# Altium project BoardControl.PrjPcb
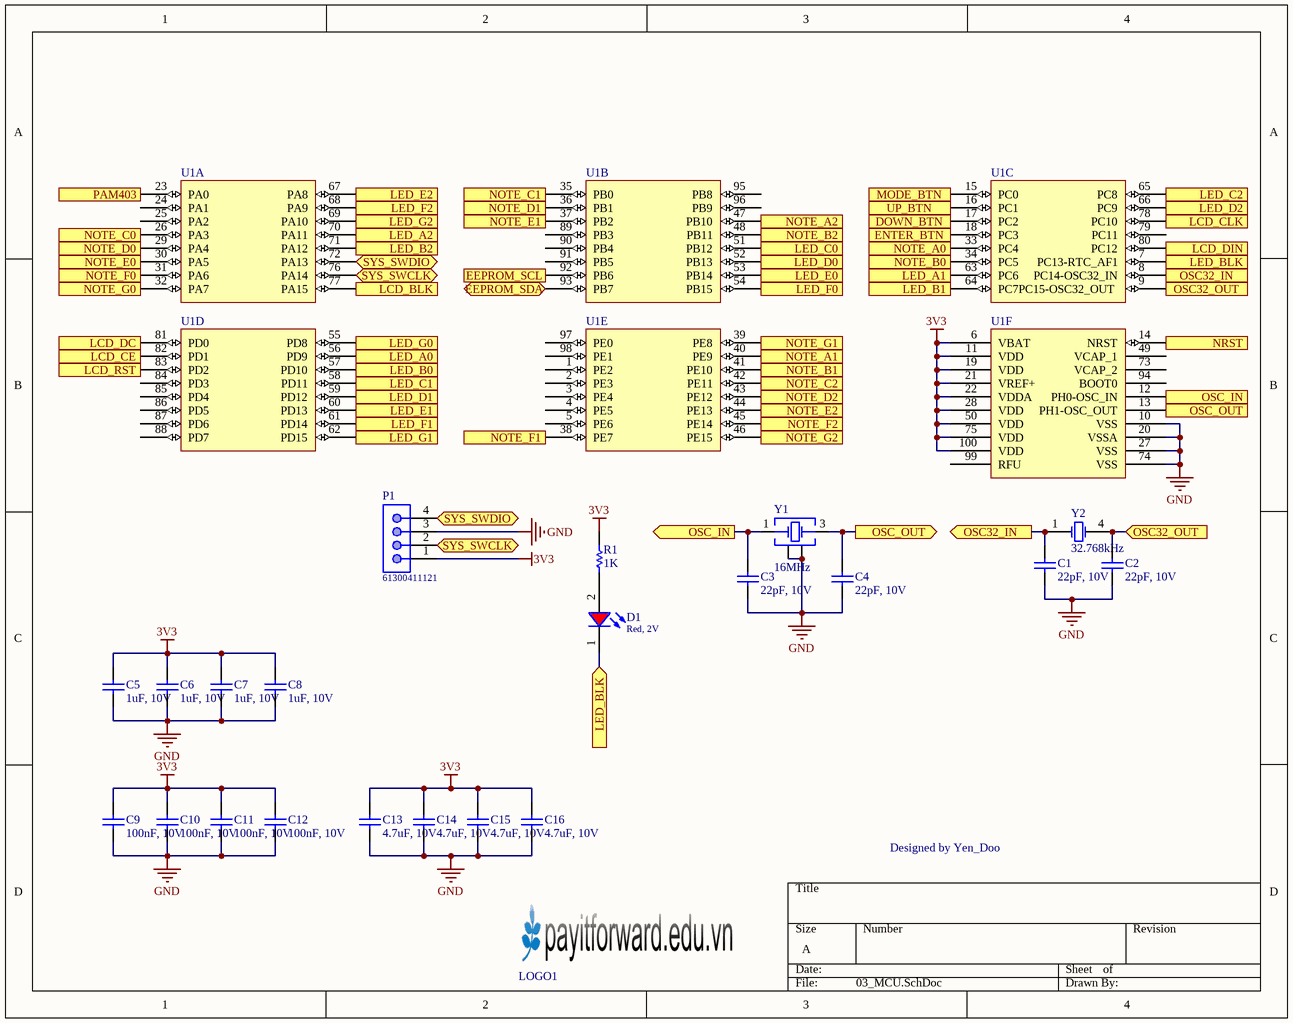
[diagram p0: 03_MCU.SchDoc]
3 sheets, 51 parts. Net scope: flat (ports and power ports of the same name join across sheets).
Board file: PCB3.PcbDoc
Sheets:
  03_MCU.SchDoc
  04_Input_Output.SchDoc
  05_Supply_Power.SchDoc

## Sheet 03_MCU.SchDoc
size A; SheetNumber: 1; SheetTotal: 3

### Parts
*  LOGO_DOO  [Logo_Top_Overlay]  (value not drawn)
C1  22pF, 10V  [WCAP-CSGP_0603_H=0.8mm_Reflow]
C2  22pF, 10V  [WCAP-CSGP_0603_H=0.8mm_Reflow]
C3  22pF, 10V  [WCAP-CSGP_0603_H=0.8mm_Reflow]
C4  22pF, 10V  [WCAP-CSGP_0603_H=0.8mm_Reflow]
C5  1uF, 10V  [WCAP-CSGP_0603_H=0.8mm_Reflow]
C6  1uF, 10V  [WCAP-CSGP_0603_H=0.8mm_Reflow]
C7  1uF, 10V  [WCAP-CSGP_0603_H=0.8mm_Reflow]
C8  1uF, 10V  [WCAP-CSGP_0603_H=0.8mm_Reflow]
C9  100nF, 10V  [WCAP-CSGP_0603_H=0.8mm_Reflow]
C10  100nF, 10V  [WCAP-CSGP_0603_H=0.8mm_Reflow]
C11  100nF, 10V  [WCAP-CSGP_0603_H=0.8mm_Reflow]
C12  100nF, 10V  [WCAP-CSGP_0603_H=0.8mm_Reflow]
C13  4.7uF, 10V  [WCAP-CSGP_0603_H=0.8mm_Reflow]
C14  4.7uF, 10V  [WCAP-CSGP_0603_H=0.8mm_Reflow]
C15  4.7uF, 10V  [WCAP-CSGP_0603_H=0.8mm_Reflow]
C16  4.7uF, 10V  [WCAP-CSGP_0603_H=0.8mm_Reflow]
D1  Red, 2V  [WL-SMCW_0603_H=0.7mm]
LOGO1  LOGO PIF  [PIF LOGO BIG SSTOP]  (value not drawn)
P1  61300411121  [61300411121]
R1  value 1K  [RES-SM-0603]  (hidden comment: RESISTOR SMD)
U1  STM32F205VCT6  [STM32F205VCT6]  (value not drawn)  (parts A,B,C,D,E,F of 6)
Y1  16MHz  [WE-XTAL_12SMX]
Y2  32.768kHz  [WE-XTAL_85SMX]

### Ports
DOWN_BTN (in), EEPROM_SCL (out), EEPROM_SDA (bidir), ENTER_BTN (in), LCD_BLK (out), LCD_CE (out), LCD_CLK (out), LCD_DC (out), LCD_DIN (in), LCD_RST (out), LED_A0 (out), LED_A1 (out), LED_A2 (out), LED_B0 (out), LED_B1 (out), LED_B2 (out), LED_BLK (in), LED_BLK (out), LED_C0 (out), LED_C1 (out), LED_C2 (out), LED_D0 (out), LED_D1 (out), LED_D2 (out), LED_E0 (out), LED_E1 (out), LED_E2 (out), LED_F0 (out), LED_F1 (out), LED_F2 (out), LED_G0 (out), LED_G1 (out), LED_G2 (out), MODE_BTN (in), NOTE_A0 (in), NOTE_A1 (in), NOTE_A2 (in), NOTE_B0 (in), NOTE_B1 (in), NOTE_B2 (in), NOTE_C0 (in), NOTE_C1 (in), NOTE_C2 (in), NOTE_D0 (in), NOTE_D1 (in), NOTE_D2 (in), NOTE_E0 (in), NOTE_E1 (in), NOTE_E2 (in), NOTE_F0 (in), NOTE_F1 (in), NOTE_F2 (in), NOTE_G0 (in), NOTE_G1 (in), NOTE_G2 (in), NRST (in), OSC32_IN (in), OSC32_IN (out), OSC32_OUT (in), OSC32_OUT (out), OSC_IN (in), OSC_IN (out), OSC_OUT (out), PAM403 (out), SYS_SWCLK (bidir), SYS_SWDIO (bidir), UP_BTN (in)

### Nets
3V3: C5.2 C6.2 C7.2 C8.2 C9.2 C10.2 C11.2 C12.2 C13.1 C14.1 C15.1 C16.1 P1.1 R1.2 U1.6(VBAT) U1.11(VDD) U1.19(VDD) U1.21(VREF+) U1.22(VDDA) U1.28(VDD) U1.50(VDD) U1.75(VDD) U1.100(VDD)
GND: C1.1 C2.1 C3.1 C4.1 C5.1 C6.1 C7.1 C8.1 C9.1 C10.1 C11.1 C12.1 C13.2 C14.2 C15.2 C16.2 P1.3 U1.10(VSS) U1.20(VSSA) U1.27(VSS) U1.74(VSS) Y1.2(GND_&_Lid) Y1.4(GND_&_Lid)
NetC1_2: C1.2 U1.8(PC14-OSC32_IN) Y2.1(Crystal) ; port OSC32_IN
NetC2_2: C2.2 U1.9(PC15-OSC32_OUT) Y2.4(Crystal) ; port OSC32_OUT
NetC3_2: C3.2 U1.12(PH0-OSC_IN) Y1.1(Crystal) ; port OSC_IN
NetC4_2: C4.2 U1.13(PH1-OSC_OUT) Y1.3(Crystal) ; port OSC_OUT
NetD1_1: D1.1(K) U1.7(PC13-RTC_AF1) ; port LED_BLK
NetD1_2: D1.2(A) R1.1
NetP1_2: P1.2 U1.76(PA14) ; port SYS_SWCLK
NetP1_4: P1.4 U1.72(PA13) ; port SYS_SWDIO
NetP2_1: U1.18(PC3) ; port ENTER_BTN
NetP2_2: U1.17(PC2) ; port DOWN_BTN
NetP2_3: U1.16(PC1) ; port UP_BTN
NetP2_4: U1.15(PC0) ; port MODE_BTN
NetP2_5: U1.14(NRST) ; port NRST
NetP3_1: U1.71(PA12) ; port LED_B2
NetP3_2: U1.70(PA11) ; port LED_A2
NetP3_3: U1.69(PA10) ; port LED_G2
NetP3_4: U1.68(PA9) ; port LED_F2
NetP3_5: U1.67(PA8) ; port LED_E2
NetP3_6: U1.66(PC9) ; port LED_D2
NetP3_7: U1.65(PC8) ; port LED_C2
NetP3_8: U1.64(PC7) ; port LED_B1
NetP3_9: U1.63(PC6) ; port LED_A1
NetP3_10: U1.62(PD15) ; port LED_G1
NetP3_11: U1.61(PD14) ; port LED_F1
NetP3_12: U1.60(PD13) ; port LED_E1
NetP3_13: U1.59(PD12) ; port LED_D1
NetP3_14: U1.58(PD11) ; port LED_C1
NetP3_15: U1.57(PD10) ; port LED_B0
NetP3_16: U1.56(PD9) ; port LED_A0
NetP3_17: U1.55(PD8) ; port LED_G0
NetP3_18: U1.54(PB15) ; port LED_F0
NetP3_19: U1.53(PB14) ; port LED_E0
NetP3_20: U1.52(PB13) ; port LED_D0
NetP3_21: U1.51(PB12) ; port LED_C0
NetP4_2: U1.48(PB11) ; port NOTE_B2
NetP4_3: U1.47(PB10) ; port NOTE_A2
NetP4_4: U1.46(PE15) ; port NOTE_G2
NetP4_5: U1.45(PE14) ; port NOTE_F2
NetP4_6: U1.44(PE13) ; port NOTE_E2
NetP4_7: U1.43(PE12) ; port NOTE_D2
NetP4_8: U1.42(PE11) ; port NOTE_C2
NetP4_9: U1.41(PE10) ; port NOTE_B1
NetP4_10: U1.40(PE9) ; port NOTE_A1
NetP4_11: U1.39(PE8) ; port NOTE_G1
NetP4_12: U1.38(PE7) ; port NOTE_F1
NetP4_13: U1.37(PB2) ; port NOTE_E1
NetP4_14: U1.36(PB1) ; port NOTE_D1
NetP4_15: U1.35(PB0) ; port NOTE_C1
NetP4_16: U1.34(PC5) ; port NOTE_B0
NetP4_17: U1.33(PC4) ; port NOTE_A0
NetP4_18: U1.32(PA7) ; port NOTE_G0
NetP4_19: U1.31(PA6) ; port NOTE_F0
NetP4_20: U1.30(PA5) ; port NOTE_E0
NetP4_21: U1.29(PA4) ; port NOTE_D0
NetP4_22: U1.26(PA3) ; port NOTE_C0
NetP5_2: U1.77(PA15) ; port LCD_BLK
NetP5_4: U1.78(PC10) ; port LCD_CLK
NetP5_5: U1.80(PC12) ; port LCD_DIN
NetP5_6: U1.81(PD0) ; port LCD_DC
NetP5_7: U1.82(PD1) ; port LCD_CE
NetP5_8: U1.83(PD2) ; port LCD_RST
NetR3_1: U1.92(PB6) ; port EEPROM_SCL
NetR4_1: U1.93(PB7) ; port EEPROM_SDA
NetU1_23: U1.23(PA0) ; port PAM403

Not connected (* = marked no-connect by the designer): U1 1(PE2) 2(PE3) 3(PE4) 4(PE5) 5(PE6) 24(PA1) 25(PA2) 49(VCAP_1) 73(VCAP_2) 79(PC11) 84(PD3) 85(PD4) 86(PD5) 87(PD6) 88(PD7) 89(PB3) 90(PB4) 91(PB5) 94(BOOT0) 95(PB8) 96(PB9) 97(PE0) 98(PE1) 99(RFU)

### Notes on the sheet
- (in symbol LOGO_DOO) Designed by Yen_Doo

### Library data of the parts
C1-C4 = 885012006004: WCAP-CSGP Multilayer Ceramic Chip Capacitor, General Purpose, size 0603, NP0, 22pF, 10V; Manufacturer: Wurth Elektronik; Rated Voltage: 10VDC; Isolation Resistance: >=10GOhm; Capacitance Tolerance: +/-5%; Dissipation Factor: Q>=400+20C; Technical Reference: NP00603220J010DFCT10000; ComponentLink1Description: Manufacturer; ComponentLink1URL: http://www.we-online.de; ComponentLink2Description: Datasheet; ComponentLink2URL: https://www.we-online.com/catalog/datasheet/885012006004.pdf; Operating Temperature: -55 to +125degC; Packaging: Tape and Reel; Manufacturer Part Number: 885012006004; Published Date: May 2020; Ceramic Type: NP0; Height: 0.8mm; Mounting Technology: SMT; Size: 0603; Capacitance: 22pF
C5-C8 = 885012106010: WCAP-CSGP Multilayer Ceramic Chip Capacitor, General Purpose, size 0603, X5R, 1uF, 10V; Manufacturer: Wurth Elektronik; Rated Voltage: 10VDC; Isolation Resistance: >=0.1GOhm; Capacitance Tolerance: +/-20%; Technical Reference: X5R0603105M010DFCT10000; ComponentLink1Description: Manufacturer; ComponentLink1URL: http://www.we-online.de; ComponentLink2Description: Datasheet; ComponentLink2URL: https://www.we-online.com/catalog/datasheet/885012106010.pdf; Operating Temperature: -55 to +85degC; Packaging: Tape and Reel; Manufacturer Part Number: 885012106010; Published Date: May 2020; Ceramic Type: X5R; Dissipation Factor: =<10%; Height: 0.8mm; Mounting Technology: SMT; Size: 0603; Capacitance: 1uF
C9-C12 = 885012206020: WCAP-CSGP Multilayer Ceramic Chip Capacitor, General Purpose, size 0603, X7R, 100nF, 10V; Manufacturer: Wurth Elektronik; Rated Voltage: 10VDC; Isolation Resistance: >=5GOhm; Capacitance Tolerance: +/-10%; Technical Reference: X7R0603104K010DFCT10000; ComponentLink1Description: Manufacturer; ComponentLink1URL: http://www.we-online.de; ComponentLink2Description: Datasheet; ComponentLink2URL: https://www.we-online.com/catalog/datasheet/885012206020.pdf; Operating Temperature: -55 to +125degC; Packaging: Tape and Reel; Manufacturer Part Number: 885012206020; Published Date: May 2020; Ceramic Type: X7R; Dissipation Factor: =<5%; Height: 0.8mm; Mounting Technology: SMT; Size: 0603; Capacitance: 100nF
C13-C16 = 885012106012: WCAP-CSGP Multilayer Ceramic Chip Capacitor, General Purpose, size 0603, X5R, 4.7uF, 10V; Manufacturer: Wurth Elektronik; Rated Voltage: 10VDC; Isolation Resistance: >=0.02GOhm; Capacitance Tolerance: +/-20%; Technical Reference: X5R0603475M010DFCT10000; ComponentLink1Description: Manufacturer; ComponentLink1URL: http://www.we-online.de; ComponentLink2Description: Datasheet; ComponentLink2URL: https://www.we-online.com/catalog/datasheet/885012106012.pdf; Operating Temperature: -55 to +85degC; Packaging: Tape and Reel; Manufacturer Part Number: 885012106012; Published Date: May 2020; Ceramic Type: X5R; Dissipation Factor: =<10%; Height: 0.8mm; Mounting Technology: SMT; Size: 0603; Capacitance: 4.7uF
D1 = 150060RS75000: WL-SMCW SMT Mono-color Chip LED Waterclear, size 0603, Red, 2V, 140deg; Chip Technology: AlInGaP; Dominant Wavelength typ.: 625nm; Luminous Intensity typ.: 250mcd; Peak Wavelength typ.: 630nm; Viewing Angle: 140deg; ComponentLink1Description: Manufacturer; ComponentLink1URL: http://www.we-online.de; ComponentLink2URL: https://www.we-online.com/catalog/datasheet/150060RS75000.pdf; ComponentLink2Description: Datasheet; Forward Voltage typ.: 2V; Emitting Color: Red; Mounting Technology: SMT; Operating Temperature: -40 to +85degC; Published Date: December 2019; Part Number: 150060RS75000; Packaging: Tape and Reel; Size: 0603; Publisher: Wurth Elektronik
P1 = 61300411121: WR-PHD Pin Header, THT, pitch 2.54mm, Single Row, Vertical, 4p; Manufacturer: Wurth Elektronik; Pin Number: 4; Rated Current: 3A; Working Voltage: 250VAC; Withstanding Voltage: 500VAC; Contact Resistance: 20mOhm; ComponentLink1Description: Manufacturer; ComponentLink1URL: http://www.we-online.de; ComponentLink2Description: Datasheet; ComponentLink2URL: https://www.we-online.com/catalog/datasheet/61300411121.pdf; Manufacturer Part Number: 61300411121; Published Date: May 2020; Pitch: 2.54mm; Operating Temperature: -40 to +105degC; Mounting Technology: THT; Packaging: Bag; Gender: Pin Header; Row Number: Single; Orientation: Vertical
R1 = RESISTOR SMD: Resistor
U1 = STM32F205VCT6: ARM® Cortex®-M3 STM32F2 Microcontroller IC 32-Bit Single-Core 120MHz 256KB (256K x 8) FLASH 100-LQFP (14x14); Mfr: STMicroelectronics; Connectivity: CANbus, I²C, IrDA, LINbus, MMC, SPI, UART/USART, USB OTG; Peripherals: Brown-out Detect/Reset, DMA, I²S, LCD, POR, PWM, WDT; Number of I/O: 82; RAM Size: 100K x 8; Voltage - Supply (Vcc/Vdd): 1.8V ~ 3.6V; Data Converters: /D 16x12b; D/A 2x12b; Oscillator Type: Internal; Series: STM32F2; Core Processor: ARM® Cortex®-M3; Core Size: 32-Bit Single-Core; Speed: 120MHz; Program Memory Size: 256KB (256K x 8); Program Memory Type: FLASH; Operating Temperature: -40°C ~ 85°C (TA); Mounting Type: Surface Mount; Package / Case: 100-LQFP; Supplier Device Package: 100-LQFP (14x14); Base Product Number: STM32F205; ComponentLink1Description: Digikey; ComponentLink1URL: https://www.digikey.com/en/products/detail/stmicroelectronics/STM32F205VCT6/2640805
Y1 = 830026392: WE-XTAL Quartz Crystal, SMT, 12SMX, 16MHz, +/-30ppm; Manufacturer: Wurth Elektronik; Frequency Stability: +/-50ppm; Load Capacitance: 16pF; ComponentLink1Description: Manufacturer; ComponentLink1URL: http://www.we-online.de; ComponentLink2Description: Datasheet; ComponentLink2URL: https://katalog.we-online.com/pbs/datasheet/830026392.pdf; Operating Temperature: -20 to +70degC; Packaging: Tape and Reel; Manufacturer Part Number: 830026392; Published Date: July 2020; Size: 12SMX; Frequency: 16MHz; Frequency Tolerance: +/-30ppm; Mounting Technology: SMT
Y2 = 830016178: WE-XTAL Watch Crystal, SMT, 85SMX, 32.768kHz, +/-20ppm; Manufacturer: Wurth Elektronik; Load Capacitance: 6pF; ComponentLink1Description: Manufacturer; ComponentLink1URL: http://www.we-online.de; ComponentLink2Description: Datasheet; ComponentLink2URL: https://katalog.we-online.com/pbs/datasheet/830016178.pdf; Operating Temperature: -40 to +85degC; Packaging: Tape and Reel; Manufacturer Part Number: 830016178; Published Date: July 2020; Size: 85SMX; Frequency Stability: -; Frequency: 32.768kHz; Frequency Tolerance: +/-20ppm; Mounting Technology: SMT

## Sheet 04_Input_Output.SchDoc
size A; SheetNumber: 2; SheetTotal: 3
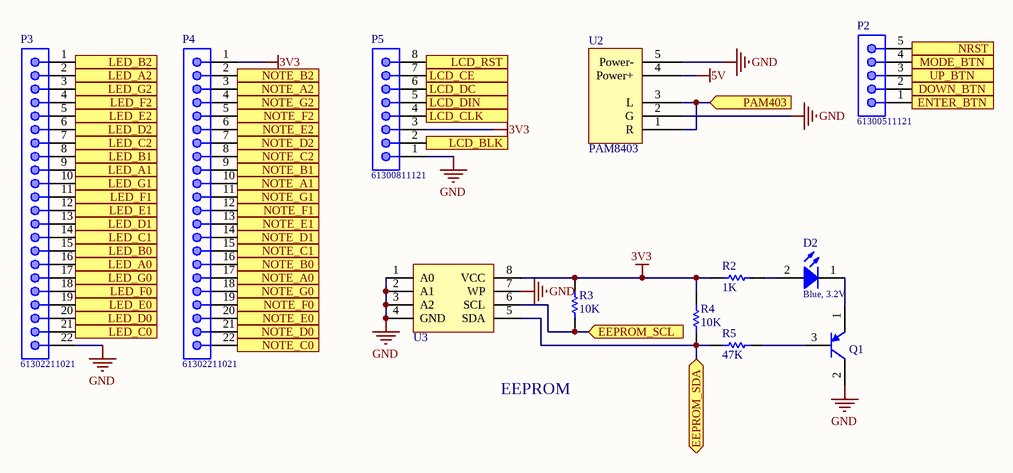
[diagram p1: 04_Input_Output.SchDoc]

### Parts
D2  Blue, 3.2V  [WL-SMCW_0603 dome]
P2  61300511121  [61300511121]
P3  61302211021  [61302211021]
P4  61302211021  [61302211021]
P5  61300811121  [61300811121]
Q1  A1015  [SOT23B]  (value not drawn)
R2  value 1K  [RES-SM-0603]  (hidden comment: RESISTOR SMD)
R3  value 10K  [RES-SM-0603]  (hidden comment: RESISTOR SMD)
R4  value 10K  [RES-SM-0603]  (hidden comment: RESISTOR SMD)
R5  value 47K  [RES-SM-0603]  (hidden comment: RESISTOR SMD)
U2  PAM8403  [PAM8403]
U3  24C256  [SOIC-8]  (value not drawn)

### Ports
DOWN_BTN (out), EEPROM_SCL (in), EEPROM_SDA (bidir), ENTER_BTN (out), LCD_BLK (in), LCD_CE (in), LCD_CLK (in), LCD_DC (in), LCD_DIN (out), LCD_RST (in), LED_A0 (in), LED_A1 (in), LED_A2 (in), LED_B0 (in), LED_B1 (in), LED_B2 (in), LED_C0 (in), LED_C1 (in), LED_C2 (in), LED_D0 (in), LED_D1 (in), LED_D2 (in), LED_E0 (in), LED_E1 (in), LED_E2 (in), LED_F0 (in), LED_F1 (in), LED_F2 (in), LED_G0 (in), LED_G1 (in), LED_G2 (in), MODE_BTN (out), NOTE_A0 (out), NOTE_A1 (out), NOTE_A2 (out), NOTE_B0 (out), NOTE_B1 (out), NOTE_B2 (out), NOTE_C0 (out), NOTE_C1 (out), NOTE_C2 (out), NOTE_D0 (out), NOTE_D1 (out), NOTE_D2 (out), NOTE_E0 (out), NOTE_E1 (out), NOTE_E2 (out), NOTE_F0 (out), NOTE_F1 (out), NOTE_F2 (out), NOTE_G0 (out), NOTE_G1 (out), NOTE_G2 (out), NRST (out), PAM403 (in), UP_BTN (out)

### Nets
3V3: P4.1 P5.3 R2.2 R3.2 R4.2 U3.8(VCC)
5V: U2.4(Power+)
GND: P3.22 P5.1 Q1.2(C) U2.2(G) U2.5(Power-) U3.1(A0) U3.2(A1) U3.3(A2) U3.4(GND) U3.7(WP)
NetD2_1: D2.1(K) Q1.1(E)
NetD2_2: D2.2(A) R2.1
NetP2_1: P2.1 ; port ENTER_BTN
NetP2_2: P2.2 ; port DOWN_BTN
NetP2_3: P2.3 ; port UP_BTN
NetP2_4: P2.4 ; port MODE_BTN
NetP2_5: P2.5 ; port NRST
NetP3_1: P3.1 ; port LED_B2
NetP3_2: P3.2 ; port LED_A2
NetP3_3: P3.3 ; port LED_G2
NetP3_4: P3.4 ; port LED_F2
NetP3_5: P3.5 ; port LED_E2
NetP3_6: P3.6 ; port LED_D2
NetP3_7: P3.7 ; port LED_C2
NetP3_8: P3.8 ; port LED_B1
NetP3_9: P3.9 ; port LED_A1
NetP3_10: P3.10 ; port LED_G1
NetP3_11: P3.11 ; port LED_F1
NetP3_12: P3.12 ; port LED_E1
NetP3_13: P3.13 ; port LED_D1
NetP3_14: P3.14 ; port LED_C1
NetP3_15: P3.15 ; port LED_B0
NetP3_16: P3.16 ; port LED_A0
NetP3_17: P3.17 ; port LED_G0
NetP3_18: P3.18 ; port LED_F0
NetP3_19: P3.19 ; port LED_E0
NetP3_20: P3.20 ; port LED_D0
NetP3_21: P3.21 ; port LED_C0
NetP4_2: P4.2 ; port NOTE_B2
NetP4_3: P4.3 ; port NOTE_A2
NetP4_4: P4.4 ; port NOTE_G2
NetP4_5: P4.5 ; port NOTE_F2
NetP4_6: P4.6 ; port NOTE_E2
NetP4_7: P4.7 ; port NOTE_D2
NetP4_8: P4.8 ; port NOTE_C2
NetP4_9: P4.9 ; port NOTE_B1
NetP4_10: P4.10 ; port NOTE_A1
NetP4_11: P4.11 ; port NOTE_G1
NetP4_12: P4.12 ; port NOTE_F1
NetP4_13: P4.13 ; port NOTE_E1
NetP4_14: P4.14 ; port NOTE_D1
NetP4_15: P4.15 ; port NOTE_C1
NetP4_16: P4.16 ; port NOTE_B0
NetP4_17: P4.17 ; port NOTE_A0
NetP4_18: P4.18 ; port NOTE_G0
NetP4_19: P4.19 ; port NOTE_F0
NetP4_20: P4.20 ; port NOTE_E0
NetP4_21: P4.21 ; port NOTE_D0
NetP4_22: P4.22 ; port NOTE_C0
NetP5_2: P5.2 ; port LCD_BLK
NetP5_4: P5.4 ; port LCD_CLK
NetP5_5: P5.5 ; port LCD_DIN
NetP5_6: P5.6 ; port LCD_DC
NetP5_7: P5.7 ; port LCD_CE
NetP5_8: P5.8 ; port LCD_RST
NetQ1_3: Q1.3(B) R5.1
NetR3_1: R3.1 U3.6(SCL) ; port EEPROM_SCL
NetR4_1: R4.1 R5.2 U3.5(SDA) ; port EEPROM_SDA
NetU1_23: U2.1(R) U2.3(L) ; port PAM403

### Notes on the sheet
- EEPROM

### Library data of the parts
D2 = 150060BS84000: WL-SMCW SMT Mono-color Chip LED Waterclear, size 0603 dome, Blue, 3.2V, 40deg; Chip Technology: InGaN; Dominant Wavelength typ.: 470nm; Luminous Intensity typ.: 560mcd; Peak Wavelength typ.: 465nm; Viewing Angle: 40deg; ComponentLink1Description: Manufacturer; ComponentLink1URL: http://www.we-online.de; ComponentLink2URL: https://www.we-online.com/catalog/datasheet/150060BS84000.pdf; ComponentLink2Description: Datasheet; Forward Voltage typ.: 3.2V; Emitting Color: Blue; Mounting Technology: SMT; Operating Temperature: -40 to +85degC; Published Date: December 2019; Part Number: 150060BS84000; Packaging: Tape and Reel; Size: 0603 dome; Publisher: Wurth Elektronik
P2 = 61300511121: WR-PHD Pin Header, THT, pitch 2.54mm, Single Row, Vertical, 5p; Manufacturer: Wurth Elektronik; Pin Number: 5; Rated Current: 3A; Working Voltage: 250VAC; Withstanding Voltage: 500VAC; Contact Resistance: 20mOhm; ComponentLink1Description: Manufacturer; ComponentLink1URL: http://www.we-online.de; ComponentLink2Description: Datasheet; ComponentLink2URL: https://www.we-online.com/catalog/datasheet/61300511121.pdf; Manufacturer Part Number: 61300511121; Published Date: May 2020; Pitch: 2.54mm; Operating Temperature: -40 to +105degC; Mounting Technology: THT; Packaging: Bag; Gender: Pin Header; Row Number: Single; Orientation: Vertical
P3 P4 = 61302211021: WR-PHD Pin Header, THT, pitch 2.54mm, Single Row, Angled, 22p; Manufacturer: Wurth Elektronik; Pin Number: 22; Rated Current: 3A; Working Voltage: 250VAC; Withstanding Voltage: 500VAC; Contact Resistance: 20mOhm; ComponentLink1Description: Manufacturer; ComponentLink1URL: http://www.we-online.de; ComponentLink2Description: Datasheet; ComponentLink2URL: https://www.we-online.com/catalog/datasheet/61302211021.pdf; Manufacturer Part Number: 61302211021; Published Date: May 2020; Pitch: 2.54mm; Operating Temperature: -40 to +105degC; Mounting Technology: THT; Packaging: Bag; Gender: Pin Header; Row Number: Single; Orientation: Angled
P5 = 61300811121: WR-PHD Pin Header, THT, pitch 2.54mm, Single Row, Vertical, 8p; Manufacturer: Wurth Elektronik; Pin Number: 8; Rated Current: 3A; Working Voltage: 250VAC; Withstanding Voltage: 500VAC; Contact Resistance: 20mOhm; ComponentLink1Description: Manufacturer; ComponentLink1URL: http://www.we-online.de; ComponentLink2Description: Datasheet; ComponentLink2URL: https://www.we-online.com/catalog/datasheet/61300811121.pdf; Manufacturer Part Number: 61300811121; Published Date: May 2020; Pitch: 2.54mm; Operating Temperature: -40 to +105degC; Mounting Technology: THT; Packaging: Bag; Gender: Pin Header; Row Number: Single; Orientation: Vertical
Q1 = A1015: PNP Bipolar Transistor
R2-R5 = RESISTOR SMD: Resistor
U3 = 24C256: EEPROM Memory IC 256Kb (32K x 8) I²C 1 MHz 550 ns 8-SOIC; Mfr: Microchip Technology; Memory Type: Non-Volatile; Clock Frequency: 1 MHz; Write Cycle Time - Word, Page: 5ms; Access Time: 550 ns; Voltage - Supply: 1.7V ~ 5.5V; Base Product Number: AT24C256C; Category: Integrated Circuits (ICs); Memory Format: EEPROM; Technology: EEPROM; Memory Size: 256Kb (32K x 8); Memory Interface: I²C; Operating Temperature: -40°C ~ 85°C (TA); Mounting Type: Surface Mount; Package / Case: 8-SOIC (0.154", 3.90mm Width); Supplier Device Package: 8-SOIC; ComponentLink1Description: Digikey; ComponentLink1URL: https://www.digikey.com/en/products/detail/microchip-technology/AT24C256C-SSHL-T/2271166

## Sheet 05_Supply_Power.SchDoc
size A; SheetNumber: 3; SheetTotal: 3
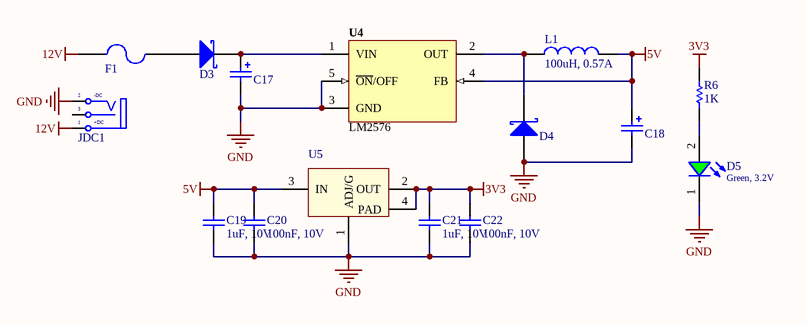
[diagram p2: 05_Supply_Power.SchDoc]

### Parts
C17  100uF  [WCAP-ATG8_D6.3H11]  (value not drawn)
C18  1000uF  [WCAP-ATG8_D10H20]  (value not drawn)
C19  1uF, 10V  [WCAP-CSGP_0603_H=0.8mm_Reflow]
C20  100nF, 10V  [WCAP-CSGP_0603_H=0.8mm_Reflow]
C21  1uF, 10V  [WCAP-CSGP_0603_H=0.8mm_Reflow]
C22  100nF, 10V  [WCAP-CSGP_0603_H=0.8mm_Reflow]
D3  D Schottky  [SS34]  (value not drawn)
D4  D Schottky  [SS34]  (value not drawn)
D5  Green, 3.2V  [WL-SMCW_0603_H=0.25mm]
F1  Fuse  [FUSE SMD]  (value not drawn)
JDC1  Jack DC  [DC-IN]  (value not drawn)
L1  100uH, 0.57A  [WE-PD2A_5848]
R6  value 1K  [RES-SM-0603]  (hidden comment: RESISTOR SMD)
U4  LM2576  [TO263]
U5  LM1117  [SOT223-4N]  (value not drawn)

### Nets
3V3: C21.2 C22.2 R6.2 U5.2(OUT) U5.4(PAD)
5V: C18.1(P) C19.2 C20.2 L1.2 U4.4(FB) U5.3(IN)
12V: F1.1 JDC1.1(T)
GND: C17.2(N) C18.2(N) C19.1 C20.1 C21.1 C22.1 D4.1(A) D5.1(K) JDC1.2(TN) U4.3(GND) U4.5(~{ON}/OFF) U5.1(ADJ/G)
NetC17_1: C17.1(P) D3.2(K) U4.1(VIN)
NetD3_1: D3.1(A) F1.2
NetD4_2: D4.2(K) L1.1 U4.2(OUT)
NetD5_2: D5.2(A) R6.1

Not connected (* = marked no-connect by the designer): JDC1 3(S)

### Notes on the sheet
- (in symbol Jack DC) -DC; +DC

### Library data of the parts
C17 = 860010473007: WCAP-ATG8 Aluminum Electrolytic Capacitor, Radial THT, D6.3xH11mm, 100uF, 25V; Manufacturer: Wurth Elektronik; Capacitance Tolerance: +/-20%; Dissipation Factor: 14%; Endurance: 2000h; Leakage Current: 25uA; Ripple Current: 209mA; Technical Reference: ATBD110101M025DSPA4B000; ComponentLink1Description: Manufacturer Link; ComponentLink1URL: https://www.we-online.com/redexpert/article/860010473007?ad; ComponentLink2Description: Datasheet; ComponentLink2URL: https://www.we-online.com/redexpert/spec/860010473007?ad; Category: Aluminum Electrolytic Capacitors; Match Code: WCAP-ATG8; Manufacturer Part Number: 860010473007; Mount: Through Hole; Operating Temperature Max: 85°C; Operating Temperature Min: -40°C; Packaging: Ammo Pack; Height: 11mm; Diameter: 6.3mm; Capacitance: 100uF; Rated Voltage (DC): 25V
C18 = 860010475017: WCAP-ATG8 Aluminum Electrolytic Capacitor, Radial THT, D10xH20mm, 1000uF, 25V; Manufacturer: Wurth Elektronik; Capacitance Tolerance: +/-20%; Dissipation Factor: 14%; Endurance: 2000h; Leakage Current: 250uA; Ripple Current: 1050mA; Technical Reference: ATBF200102M025DSPAAB000; ComponentLink1Description: Manufacturer Link; ComponentLink1URL: https://www.we-online.com/redexpert/article/860010475017?ad; ComponentLink2Description: Datasheet; ComponentLink2URL: https://www.we-online.com/redexpert/spec/860010475017?ad; Category: Aluminum Electrolytic Capacitors; Match Code: WCAP-ATG8; Manufacturer Part Number: 860010475017; Mount: Through Hole; Operating Temperature Max: 85°C; Operating Temperature Min: -40°C; Packaging: Ammo Pack; Height: 20mm; Diameter: 10mm; Capacitance: 1000uF; Rated Voltage (DC): 25V
C19 C21 = 885012106010: as C5 on sheet 03_MCU; ComponentLink1Description: Manufacturer; ComponentLink1URL: http://www.we-online.de; ComponentLink2Description: Datasheet; ComponentLink2URL: https://www.we-online.com/catalog/datasheet/885012106010.pdf; Operating Temperature: -55 to +85degC; Packaging: Tape and Reel; Manufacturer Part Number: 885012106010; Published Date: May 2020; Ceramic Type: X5R; Dissipation Factor: =<10%; Height: 0.8mm; Mounting Technology: SMT; Size: 0603; Capacitance: 1uF
C20 C22 = 885012206020: as C9 on sheet 03_MCU; ComponentLink1Description: Manufacturer; ComponentLink1URL: http://www.we-online.de; ComponentLink2Description: Datasheet; ComponentLink2URL: https://www.we-online.com/catalog/datasheet/885012206020.pdf; Operating Temperature: -55 to +125degC; Packaging: Tape and Reel; Manufacturer Part Number: 885012206020; Published Date: May 2020; Ceramic Type: X7R; Dissipation Factor: =<5%; Height: 0.8mm; Mounting Technology: SMT; Size: 0603; Capacitance: 100nF
D3 D4 = D Schottky: Schottky Diode; Published: 8-Jun-2000; LatestRevisionDate: 17-Jul-2002; LatestRevisionNote: Re-released for DXP Platform.; PackageReference: SMB; Publisher: Altium Limited; PackageDescription: DO-214-AA/SMB; 2 C-Bend Leads; Body 5.3 x 3.6 mm, inc. leads (LxW); Code_JEDEC: DO-214-AA
D5 = 150060GS75020: WL-SMCW SMT Mono-color Chip LED Waterclear, size 0603, Green, 3.2V, 140deg; Chip Technology: InGaN; Dominant Wavelength typ.: 525nm; Luminous Intensity typ.: 700mcd; Peak Wavelength typ.: 515nm; Viewing Angle: 140deg; ComponentLink1Description: Manufacturer; ComponentLink1URL: http://www.we-online.de; ComponentLink2URL: https://www.we-online.com/catalog/datasheet/150060GS75020.pdf; ComponentLink2Description: Datasheet; Forward Voltage typ.: 3.2V; Emitting Color: Green; Mounting Technology: SMT; Operating Temperature: -40 to +85degC; Published Date: March 2020; Part Number: 150060GS75020; Packaging: Tape and Reel; Size: 0603; Publisher: Wurth Elektronik
JDC1 = Jack DC: Jack DC input; Value: Jac DC
L1 = 78477420: WE-PD2A SMT Power Inductor, size 5848, 100uH, 0.57A; Manufacturer: Wurth Elektronik; DC Resistance max.: 0.65Ohm; Saturation Current: 0.68A; Self Resonant Frequency: 7MHz; DC Resistance typ.: 0.51Ohm; Rated Voltage: 80VDC; ComponentLink1Description: Manufacturer; ComponentLink1URL: http://www.we-online.de; ComponentLink2Description: Datasheet; ComponentLink2URL: https://www.we-online.com/catalog/datasheet/78477420.pdf; Manufacturer Part Number: 78477420; Published Date: May 2020; Rated Current: 0.57A; Inductance: 100uH; Operating Temperature: -40 to +125degC; Mounting Technology: SMT; Packaging: Tape and Reel; Size: 5848
R6 = RESISTOR SMD: Resistor
U4 = LM2576: Max Input Voltage: 12 V; Max Output Current: 3 (6.0 peak) A; Max Output Voltage: mV; Category: IC-Power; Min Input Voltage: mV; Min Output Voltage: mV; Mounting Technology: Surface Mount; Status: Unreleased; Supply Voltage: mV; Temperature Range: -40 to +125 degC
U5 = LM1117: Available in 1.8V, 2.5V, 2.85V, 3.3V, 5V, and  Adjustable Versions; Value: LM317

## Nets that join several sheets
3V3: 03_MCU (23 pins), 04_Input_Output (6 pins), 05_Supply_Power (5 pins)
5V: 04_Input_Output (U2.4), 05_Supply_Power (6 pins)
GND: 03_MCU (23 pins), 04_Input_Output (10 pins), 05_Supply_Power (12 pins)
NetP2_1: 03_MCU (U1.18), 04_Input_Output (P2.1)
NetP2_2: 03_MCU (U1.17), 04_Input_Output (P2.2)
NetP2_3: 03_MCU (U1.16), 04_Input_Output (P2.3)
NetP2_4: 03_MCU (U1.15), 04_Input_Output (P2.4)
NetP2_5: 03_MCU (U1.14), 04_Input_Output (P2.5)
NetP3_1: 03_MCU (U1.71), 04_Input_Output (P3.1)
NetP3_2: 03_MCU (U1.70), 04_Input_Output (P3.2)
NetP3_3: 03_MCU (U1.69), 04_Input_Output (P3.3)
NetP3_4: 03_MCU (U1.68), 04_Input_Output (P3.4)
NetP3_5: 03_MCU (U1.67), 04_Input_Output (P3.5)
NetP3_6: 03_MCU (U1.66), 04_Input_Output (P3.6)
NetP3_7: 03_MCU (U1.65), 04_Input_Output (P3.7)
NetP3_8: 03_MCU (U1.64), 04_Input_Output (P3.8)
NetP3_9: 03_MCU (U1.63), 04_Input_Output (P3.9)
NetP3_10: 03_MCU (U1.62), 04_Input_Output (P3.10)
NetP3_11: 03_MCU (U1.61), 04_Input_Output (P3.11)
NetP3_12: 03_MCU (U1.60), 04_Input_Output (P3.12)
NetP3_13: 03_MCU (U1.59), 04_Input_Output (P3.13)
NetP3_14: 03_MCU (U1.58), 04_Input_Output (P3.14)
NetP3_15: 03_MCU (U1.57), 04_Input_Output (P3.15)
NetP3_16: 03_MCU (U1.56), 04_Input_Output (P3.16)
NetP3_17: 03_MCU (U1.55), 04_Input_Output (P3.17)
NetP3_18: 03_MCU (U1.54), 04_Input_Output (P3.18)
NetP3_19: 03_MCU (U1.53), 04_Input_Output (P3.19)
NetP3_20: 03_MCU (U1.52), 04_Input_Output (P3.20)
NetP3_21: 03_MCU (U1.51), 04_Input_Output (P3.21)
NetP4_2: 03_MCU (U1.48), 04_Input_Output (P4.2)
NetP4_3: 03_MCU (U1.47), 04_Input_Output (P4.3)
NetP4_4: 03_MCU (U1.46), 04_Input_Output (P4.4)
NetP4_5: 03_MCU (U1.45), 04_Input_Output (P4.5)
NetP4_6: 03_MCU (U1.44), 04_Input_Output (P4.6)
NetP4_7: 03_MCU (U1.43), 04_Input_Output (P4.7)
NetP4_8: 03_MCU (U1.42), 04_Input_Output (P4.8)
NetP4_9: 03_MCU (U1.41), 04_Input_Output (P4.9)
NetP4_10: 03_MCU (U1.40), 04_Input_Output (P4.10)
NetP4_11: 03_MCU (U1.39), 04_Input_Output (P4.11)
NetP4_12: 03_MCU (U1.38), 04_Input_Output (P4.12)
NetP4_13: 03_MCU (U1.37), 04_Input_Output (P4.13)
NetP4_14: 03_MCU (U1.36), 04_Input_Output (P4.14)
NetP4_15: 03_MCU (U1.35), 04_Input_Output (P4.15)
NetP4_16: 03_MCU (U1.34), 04_Input_Output (P4.16)
NetP4_17: 03_MCU (U1.33), 04_Input_Output (P4.17)
NetP4_18: 03_MCU (U1.32), 04_Input_Output (P4.18)
NetP4_19: 03_MCU (U1.31), 04_Input_Output (P4.19)
NetP4_20: 03_MCU (U1.30), 04_Input_Output (P4.20)
NetP4_21: 03_MCU (U1.29), 04_Input_Output (P4.21)
NetP4_22: 03_MCU (U1.26), 04_Input_Output (P4.22)
NetP5_2: 03_MCU (U1.77), 04_Input_Output (P5.2)
NetP5_4: 03_MCU (U1.78), 04_Input_Output (P5.4)
NetP5_5: 03_MCU (U1.80), 04_Input_Output (P5.5)
NetP5_6: 03_MCU (U1.81), 04_Input_Output (P5.6)
NetP5_7: 03_MCU (U1.82), 04_Input_Output (P5.7)
NetP5_8: 03_MCU (U1.83), 04_Input_Output (P5.8)
NetR3_1: 03_MCU (U1.92), 04_Input_Output (R3.1 U3.6)
NetR4_1: 03_MCU (U1.93), 04_Input_Output (R4.1 R5.2 U3.5)
NetU1_23: 03_MCU (U1.23), 04_Input_Output (U2.1 U2.3)